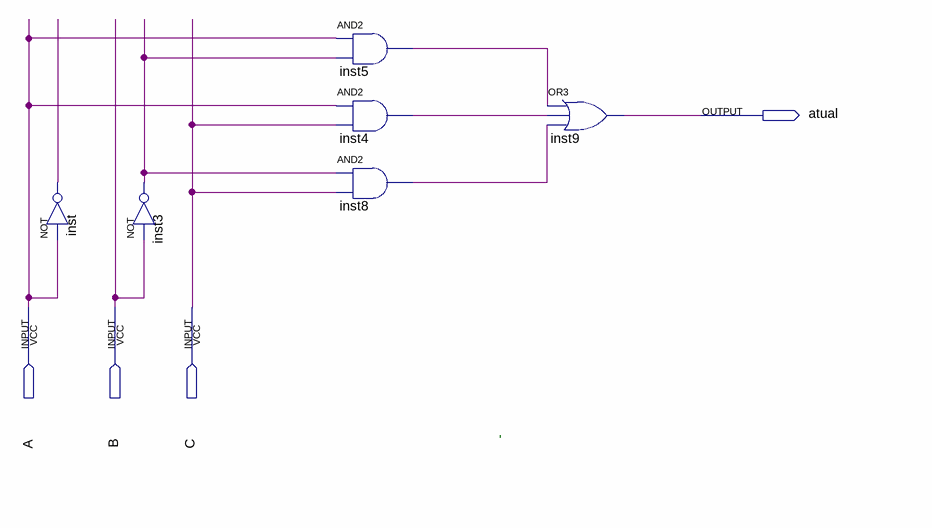
[diagram p0: schematic sheet]
// Quartus schematic Comparador1Bit.bdf as structural Verilog: 6 symbols, 4 pins
module Comparador1Bit (
  input  A,
  input  B,
  input  C,
  output atual
);

  wire inst3_out, inst4_out, inst5_out, inst8_out, inst_out;

  not inst (inst_out, A);
  not inst3 (inst3_out, B);
  and inst5 (inst5_out, A, inst3_out);
  and inst4 (inst4_out, A, C);
  and inst8 (inst8_out, inst3_out, C);
  or inst9 (atual, inst5_out, inst4_out, inst8_out);

  // Notes on the sheet:
  //   '
endmodule
